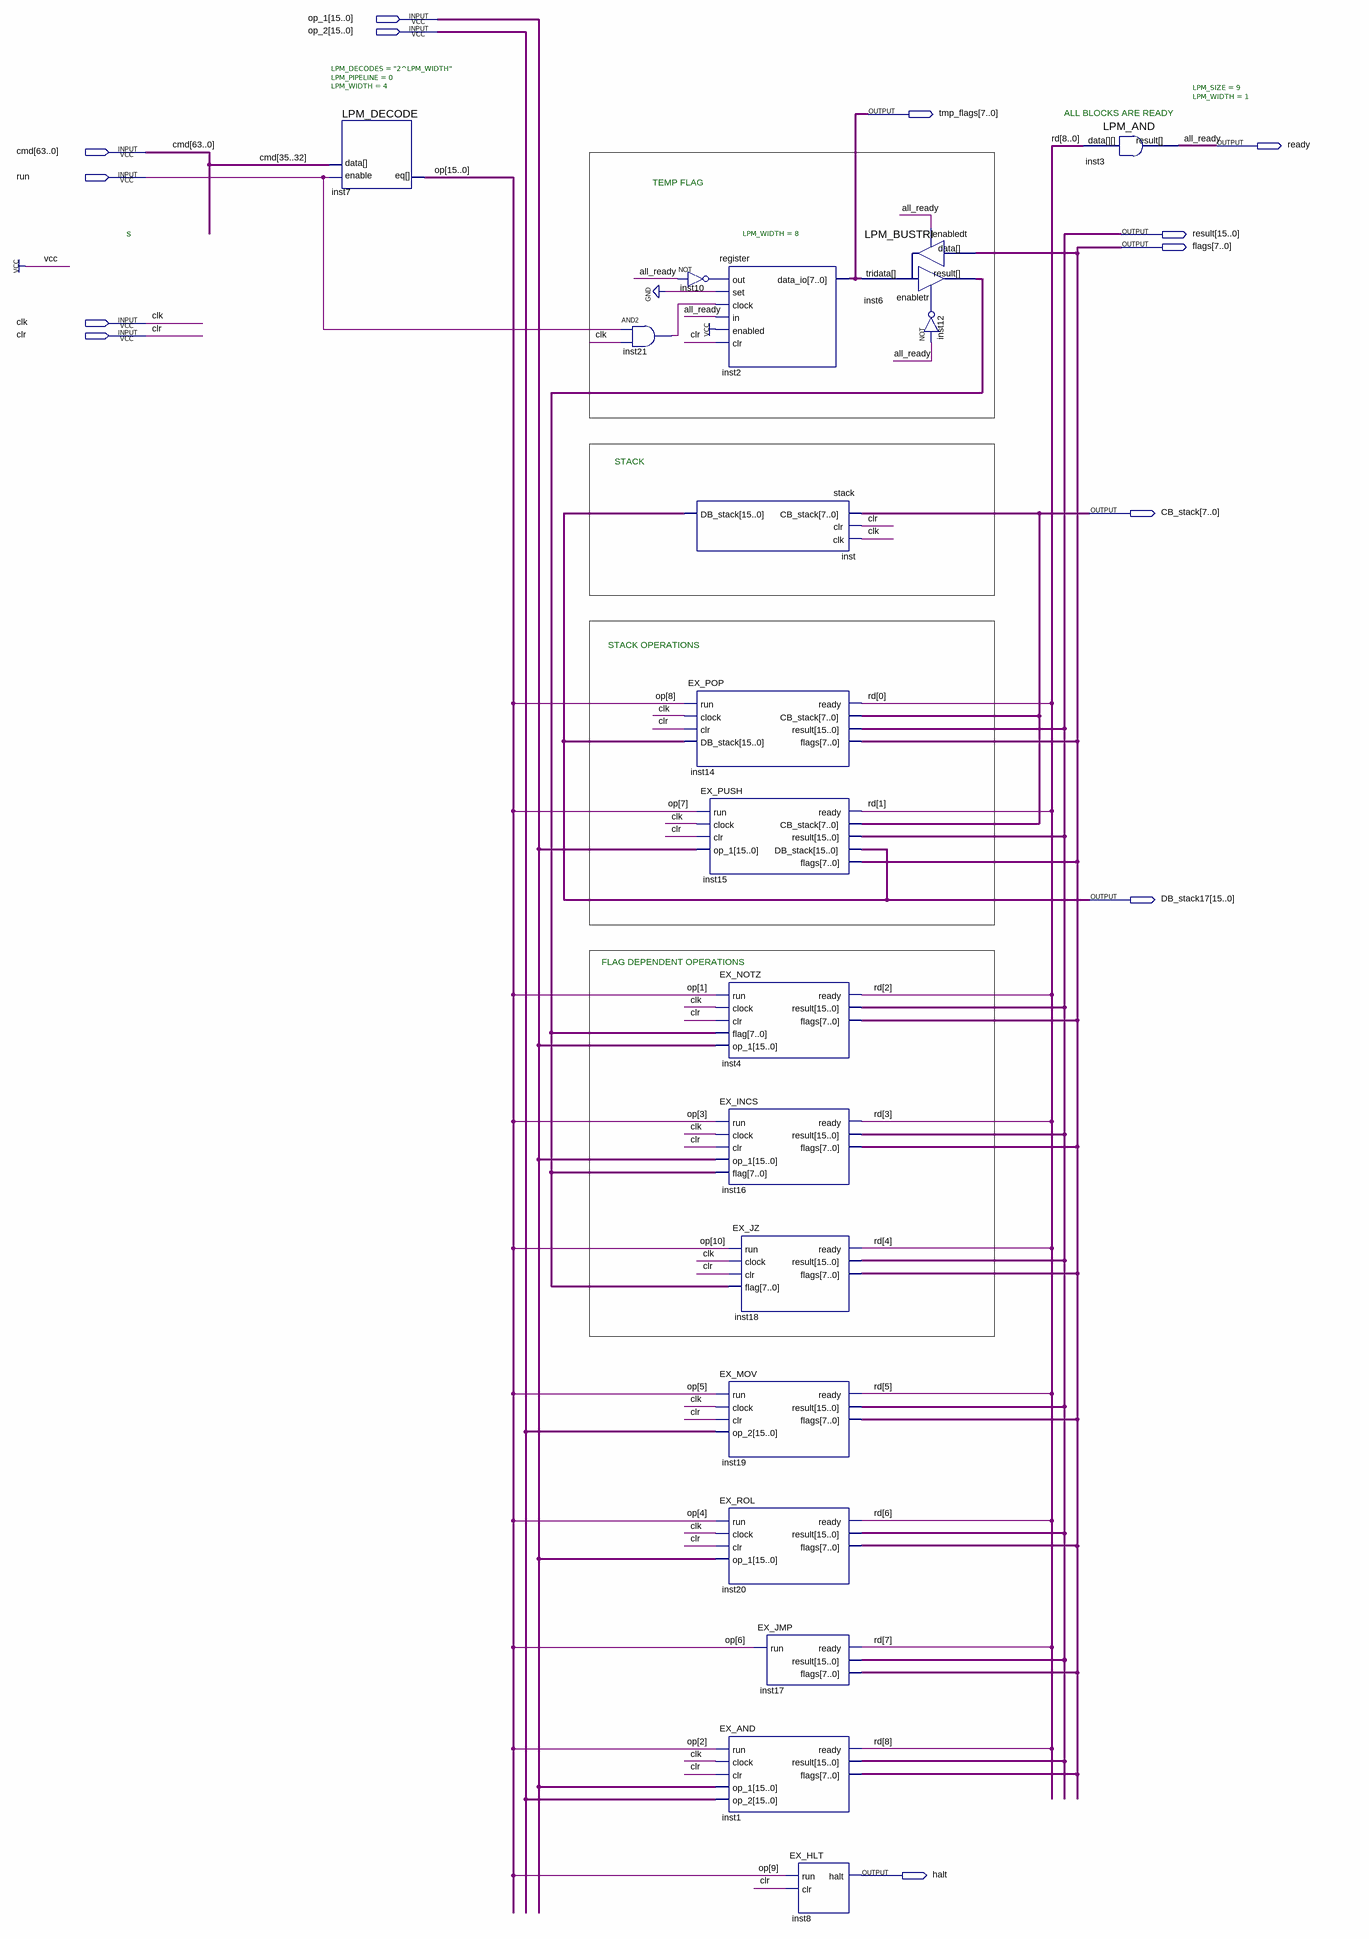
[diagram p0: schematic sheet]
// Quartus schematic EXEC.bdf as structural Verilog: 18 symbols, 13 pins
module EXEC (
  input  [15:0] op_1,
  input  [15:0] op_2,
  input  [63:0] cmd,
  input  run,
  input  clk,
  input  clr,
  output [7:0] tmp_flags,
  output ready,
  output [15:0] result,
  output [7:0] flags,
  output [7:0] CB_stack,
  output [15:0] DB_stack17,
  output halt
);

  wire inst10_out, inst12_out, inst21_out;
  wire [7:0] inst6_result;
  wire [8:0] rd;
  wire [15:0] op;

  LPM_DECODE #(.LPM_DECODES("2^LPM_WIDTH"), .LPM_PIPELINE(0), .LPM_WIDTH(4)) inst7 (
    .enable(run), .data(cmd[35:32]), .eq(op));
  and inst21 (inst21_out, run, clk);
  register inst2 (
    .out(inst10_out), .set(1'b0), .clock(inst21_out), .in(ready), .enabled(1'b1), .clr(clr),
    .data_io(tmp_flags));
  not inst10 (inst10_out, ready);
  stack inst (.CB_stack(CB_stack), .clr(clr), .clk(clk), .DB_stack(DB_stack17));
  EX_POP inst14 (
    .run(op[8]), .clock(clk), .clr(clr), .DB_stack(DB_stack17), .ready(rd[0]), .CB_stack(CB_stack),
    .result(result), .flags(flags));
  EX_PUSH inst15 (
    .run(op[7]), .clock(clk), .clr(clr), .op_1(op_1), .ready(rd[1]), .CB_stack(CB_stack), .result(result),
    .flags(flags), .DB_stack(DB_stack17));
  EX_NOTZ inst4 (
    .run(op[1]), .clock(clk), .clr(clr), .flag(inst6_result), .op_1(op_1), .ready(rd[2]), .result(result),
    .flags(flags));
  EX_INCS inst16 (
    .run(op[3]), .clock(clk), .clr(clr), .op_1(op_1), .flag(inst6_result), .ready(rd[3]), .result(result),
    .flags(flags));
  EX_MOV inst19 (.run(op[5]), .clock(clk), .clr(clr), .op_2(op_2), .ready(rd[5]), .result(result), .flags(flags));
  EX_ROL inst20 (.run(op[4]), .clock(clk), .clr(clr), .op_1(op_1), .ready(rd[6]), .result(result), .flags(flags));
  EX_AND inst1 (
    .run(op[2]), .clock(clk), .clr(clr), .op_1(op_1), .op_2(op_2), .ready(rd[8]), .result(result),
    .flags(flags));
  EX_JZ inst18 (
    .run(op[10]), .clock(clk), .clr(clr), .flag(inst6_result), .ready(rd[4]), .result(result), .flags(flags));
  EX_JMP inst17 (.run(op[6]), .ready(rd[7]), .result(result), .flags(flags));
  EX_HLT inst8 (.run(op[9]), .clr(clr), .halt(halt));
  LPM_BUSTRI #(.LPM_WIDTH(8)) inst6 (
    .data(flags), .enabledt(ready), .enabletr(inst12_out), .result(inst6_result), .tridata(tmp_flags));
  not inst12 (inst12_out, ready);
  LPM_AND #(.LPM_SIZE(9), .LPM_WIDTH(1)) inst3 (.data(rd), .result(ready));

  // Other names for the same wires on the sheet: all_ready = ready

  // Notes on the sheet:
  //   ALL BLOCKS ARE READY
  //   TEMP FLAG
  //   s
  //   STACK
  //   STACK OPERATIONS
  //   FLAG DEPENDENT OPERATIONS
endmodule
